# Altium schematic sheet MCU2.SchDoc
size 420 x 297 mm; Address1: Address1; Address2: Address2; Address3: Address3; Address4: Address4; SheetNumber: 3; SheetTotal: 4; Scale: 1:1; DocumentType: Схема электрическая принципиальная
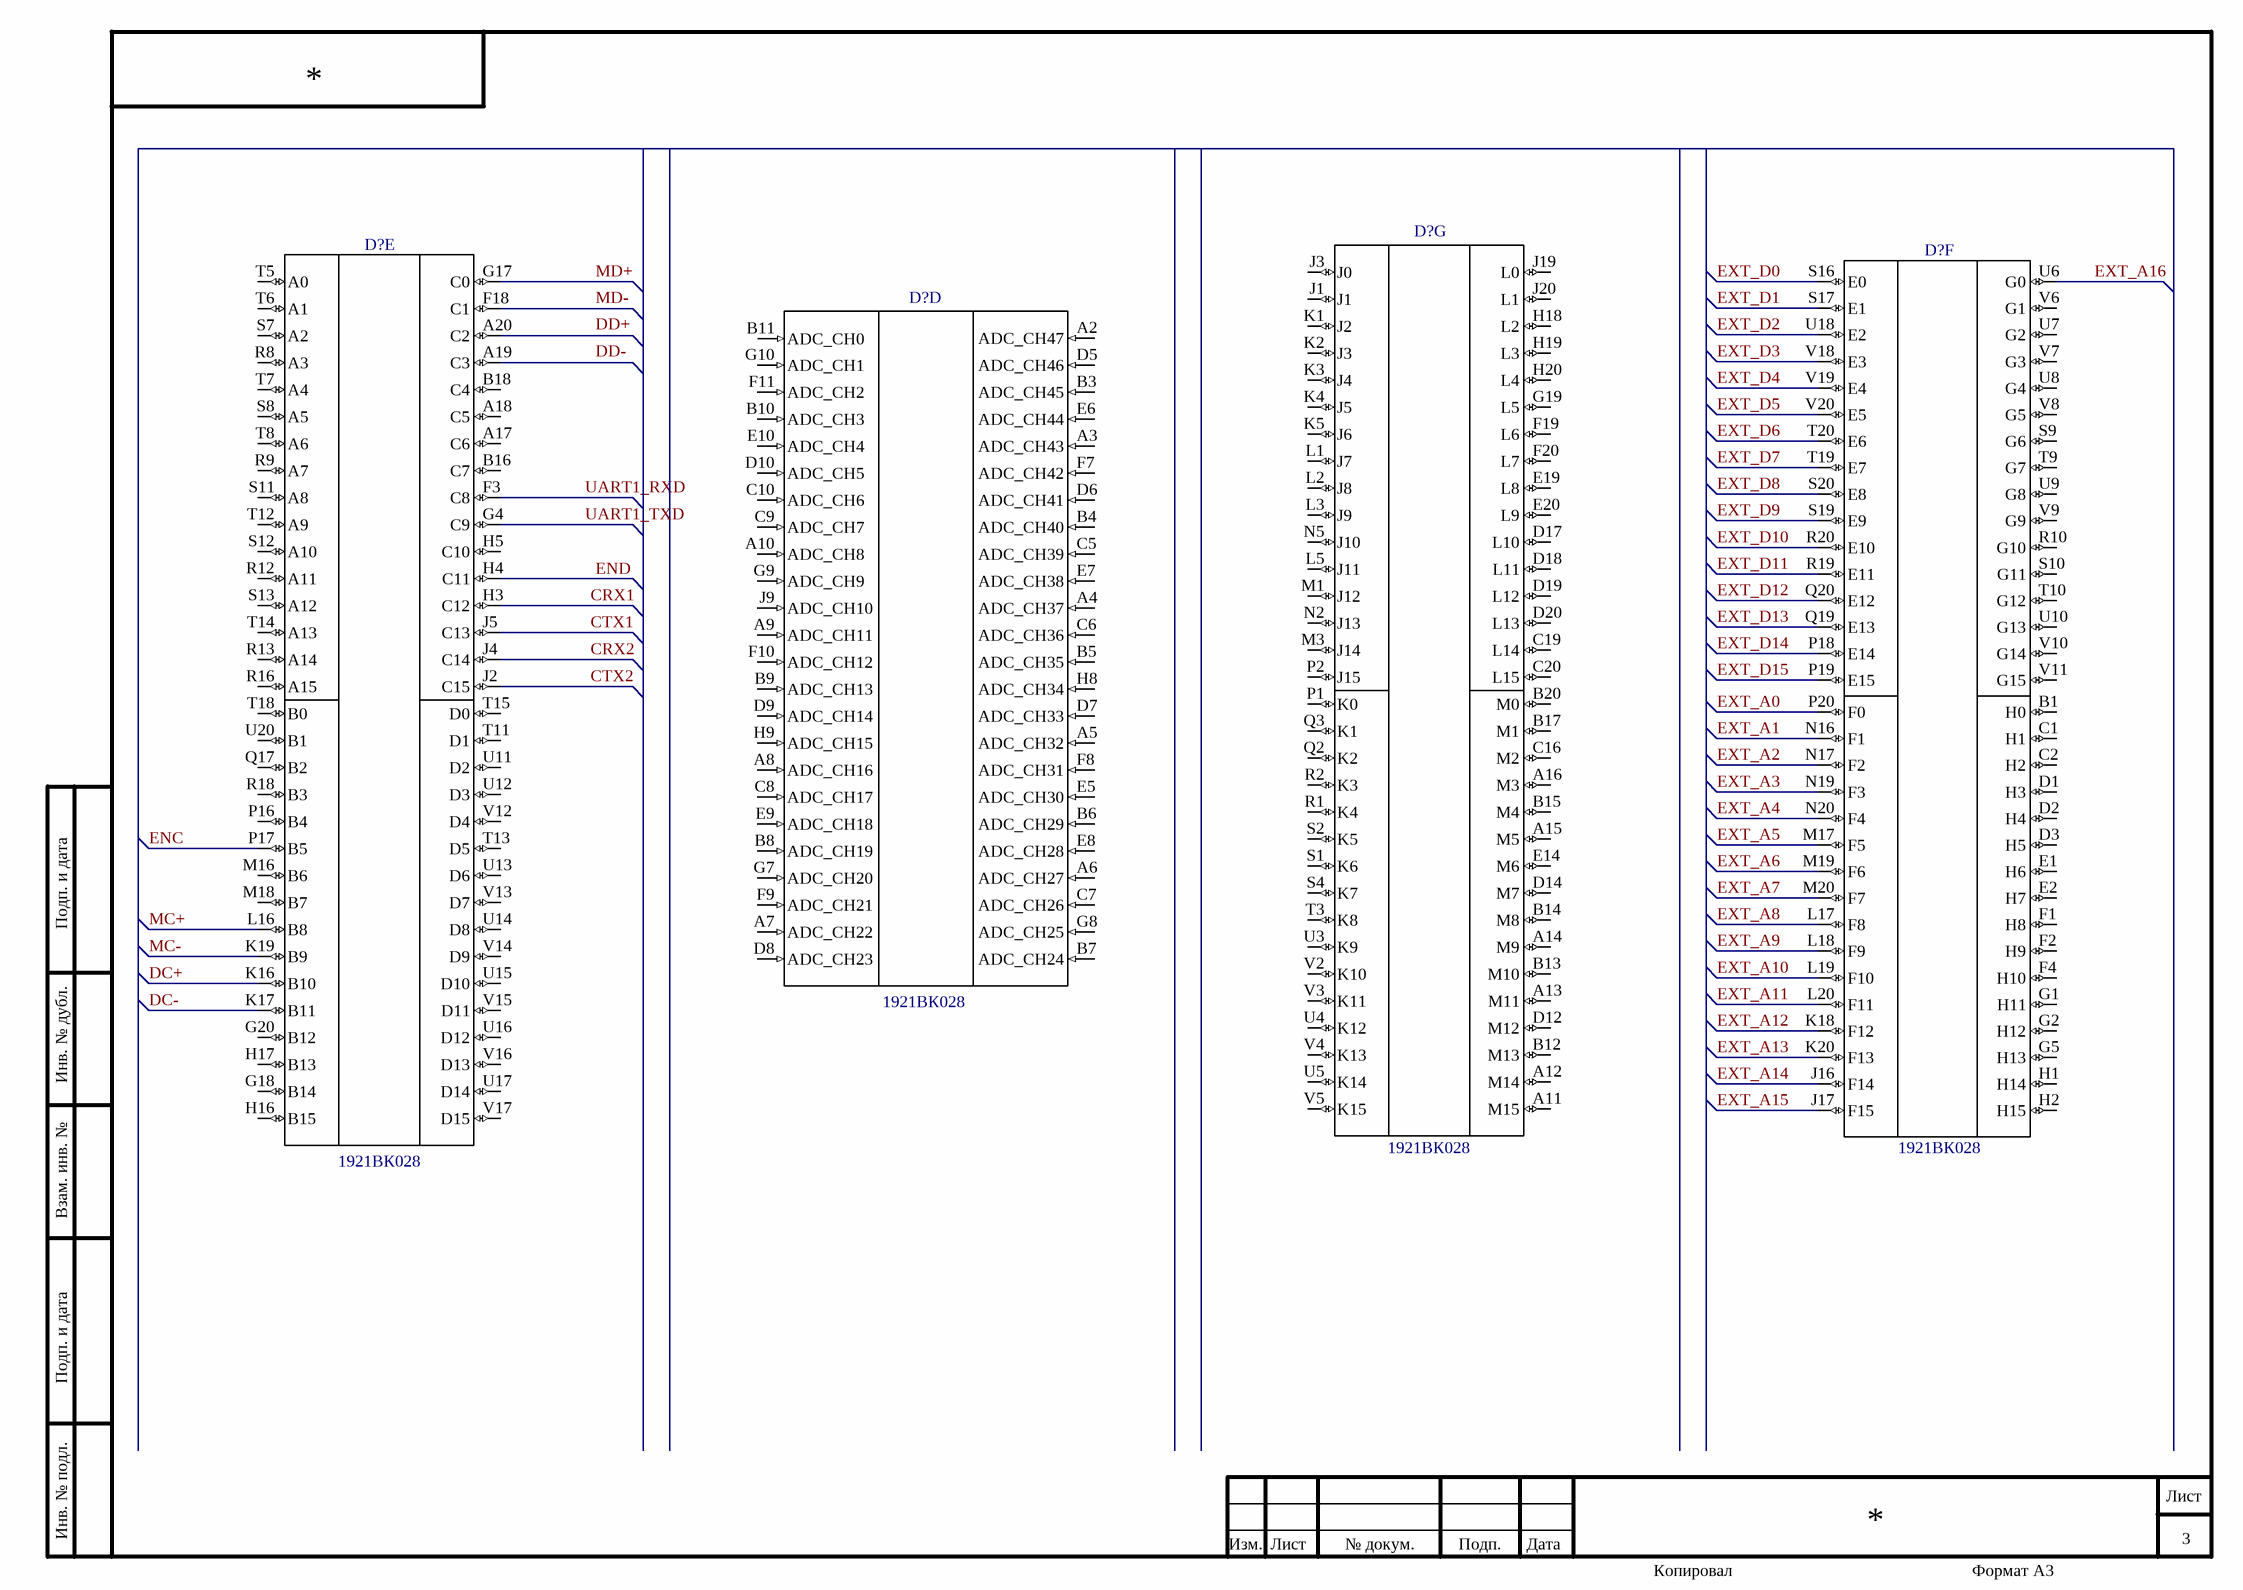
[diagram p0: MCU2.SchDoc]

## Parts
(Parts that share a designator on the sheet are numbered #1, #2 ... from top to bottom, then left to right.)
D?#1  1921ВК028  (part G of 8)
D?#2  1921ВК028  (part E of 8)
D?#3  1921ВК028  (part F of 8)
D?#4  1921ВК028  (part D of 8)

## Nets
CRX1: D?#2.H3(C12)
CRX2: D?#2.J4(C14)
CTX1: D?#2.J5(C13)
CTX2: D?#2.J2(C15)
DC+: D?#2.K16(B10)
DC-: D?#2.K17(B11)
ENC: D?#2.P17(B5)
END: D?#2.H4(C11)
EXT_A0: D?#3.P20(F0)
EXT_A1: D?#3.N16(F1)
EXT_A2: D?#3.N17(F2)
EXT_A3: D?#3.N19(F3)
EXT_A4: D?#3.N20(F4)
EXT_A5: D?#3.M17(F5)
EXT_A6: D?#3.M19(F6)
EXT_A7: D?#3.M20(F7)
EXT_A8: D?#3.L17(F8)
EXT_A9: D?#3.L18(F9)
EXT_A10: D?#3.L19(F10)
EXT_A11: D?#3.L20(F11)
EXT_A12: D?#3.K18(F12)
EXT_A13: D?#3.K20(F13)
EXT_A14: D?#3.J16(F14)
EXT_A15: D?#3.J17(F15)
EXT_A16: D?#3.U6(G0)
EXT_D0: D?#3.S16(E0)
EXT_D1: D?#3.S17(E1)
EXT_D2: D?#3.U18(E2)
EXT_D3: D?#3.V18(E3)
EXT_D4: D?#3.V19(E4)
EXT_D5: D?#3.V20(E5)
EXT_D6: D?#3.T20(E6)
EXT_D7: D?#3.T19(E7)
EXT_D8: D?#3.S20(E8)
EXT_D9: D?#3.S19(E9)
EXT_D10: D?#3.R20(E10)
EXT_D11: D?#3.R19(E11)
EXT_D12: D?#3.Q20(E12)
EXT_D13: D?#3.Q19(E13)
EXT_D14: D?#3.P18(E14)
EXT_D15: D?#3.P19(E15)
MC+: D?#2.L16(B8)
MC-: D?#2.K19(B9)
MD+: D?#2.G17(C0)
MD-: D?#2.F18(C1)
UART1_RXD: D?#2.F3(C8)
UART1_TXD: D?#2.G4(C9)

Not connected (* = marked no-connect by the designer): D?#1 A11(M15) A12(M14) A13(M11) A14(M9) A15(M5) A16(M3) B12(M13) B13(M10) B14(M8) B15(M4) B17(M1) B20(M0) C16(M2) C19(L14) C20(L15) D12(M12) D14(M7) D17(L10) D18(L11) D19(L12) D20(L13) E14(M6) E19(L8) E20(L9) F19(L6) F20(L7) G19(L5) H18(L2) H19(L3) H20(L4) J1 J3(J0) J19(L0) J20(L1) K1(J2) K2(J3) K3(J4) K4(J5) K5(J6) L1(J7) L2(J8) L3(J9) L5(J11) M1(J12) M3(J14) N2(J13) N5(J10) P1(K0) P2(J15) Q2(K2) Q3(K1) R1(K4) R2(K3) S1(K6) S2(K5) S4(K7) T3(K8) U3(K9) U4(K12) U5(K14) V2(K10) V3(K11) V4(K13) V5(K15); D?#2 A17(C6) A18(C5) A19(C3) A20(C2) B16(C7) B18(C4) G18(B14) G20(B12) H5(C10) H16(B15) H17(B13) M16(B6) M18(B7) P16(B4) Q17(B2) R8(A3) R9(A7) R12(A11) R13(A14) R16(A15) R18(B3) S7(A2) S8(A5) S11(A8) S12(A10) S13(A12) T5(A0) T6(A1) T7(A4) T8(A6) T11(D1) T12(A9) T13(D5) T14(A13) T15(D0) T18(B0) U11(D2) U12(D3) U13(D6) U14(D8) U15(D10) U16(D12) U17(D14) U20(B1) V12(D4) V13(D7) V14(D9) V15(D11) V16(D13) V17(D15); D?#3 B1(H0) C1(H1) C2(H2) D1(H3) D2(H4) D3(H5) E1(H6) E2(H7) F1(H8) F2(H9) F4(H10) G1(H11) G2(H12) G5(H13) H1(H14) H2(H15) R10(G10) S9(G6) S10(G11) T9(G7) T10(G12) U7(G2) U8(G4) U9(G8) U10(G13) V6(G1) V7(G3) V8(G5) V9(G9) V10(G14) V11(G15); D?#4 A2(ADC_CH47) A3(ADC_CH43) A4(ADC_CH37) A5(ADC_CH32) A6(ADC_CH27) A7(ADC_CH22) A8(ADC_CH16) A9(ADC_CH11) A10(ADC_CH8) B3(ADC_CH45) B4(ADC_CH40) B5(ADC_CH35) B6(ADC_CH29) B7(ADC_CH24) B8(ADC_CH19) B9(ADC_CH13) B10(ADC_CH3) B11(ADC_CH0) C5(ADC_CH39) C6(ADC_CH36) C7(ADC_CH26) C8(ADC_CH17) C9(ADC_CH7) C10(ADC_CH6) D5(ADC_CH46) D6(ADC_CH41) D7(ADC_CH33) D8(ADC_CH23) D9(ADC_CH14) D10(ADC_CH5) E5(ADC_CH30) E6(ADC_CH44) E7(ADC_CH38) E8(ADC_CH28) E9(ADC_CH18) E10(ADC_CH4) F7(ADC_CH42) F8(ADC_CH31) F9(ADC_CH21) F10(ADC_CH12) F11(ADC_CH2) G7(ADC_CH20) G8(ADC_CH25) G9(ADC_CH9) G10(ADC_CH1) H8(ADC_CH34) H9(ADC_CH15) J9(ADC_CH10)

## Notes on the sheet
- Подп. и дата
- Инв. № дубл.
- Взам. инв. №
- Инв. № подл.
- Изм.
- Лист
- № докум.
- Подп.
- Дата
- Копировал
- Формат А3
- Labels drawn without touching a wire or pin: DD+, DD-

## Library data of the parts
D?#1-D?#4 = 1921ВК028: МК 1921ВК028